# EAGLE schematic ESPSwitchBoard (EAGLE 7.3.0)
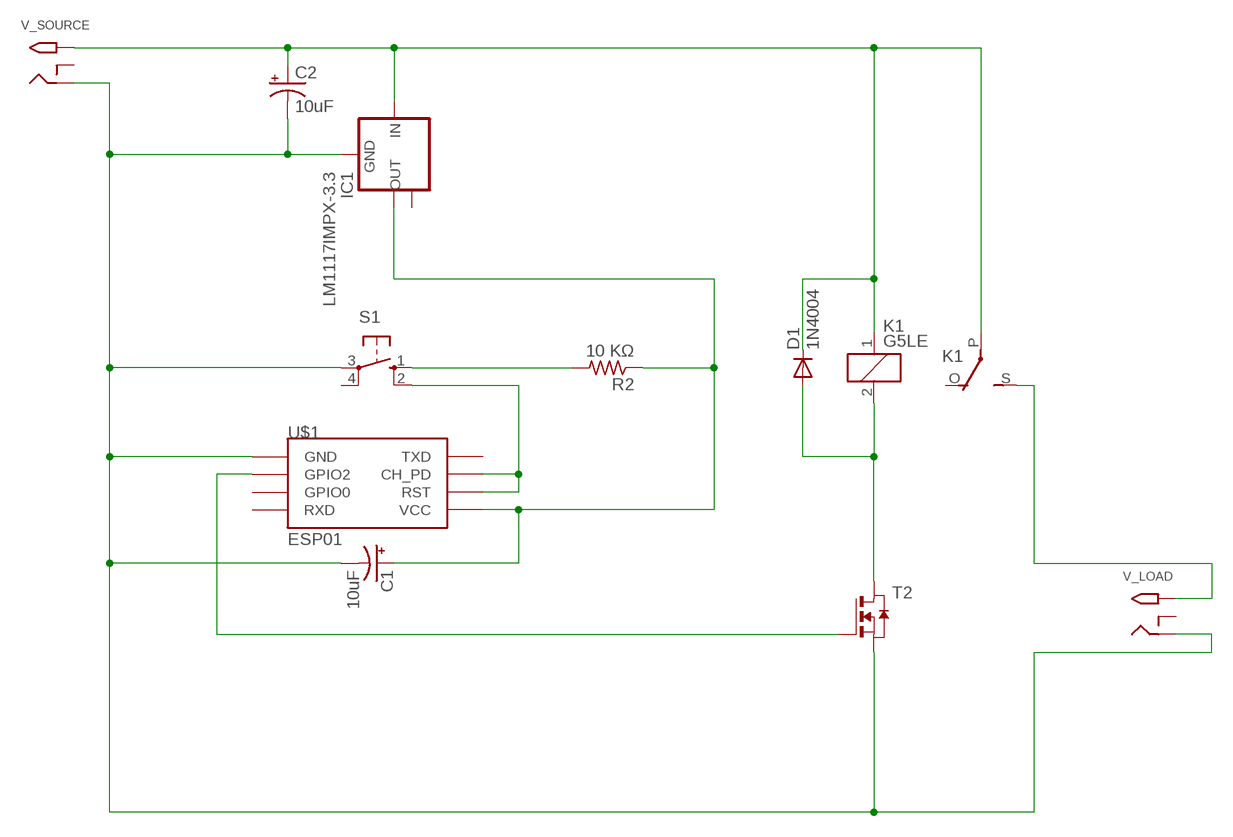
[diagram p0: schematic, sheet 1]

## Parts
C1  10uF  10UF-TANT  [EIA3216]
C2  10uF  10UF-TANT  [EIA3216]
D1  1N4004  [DO41-10]
IC1  LM1117IMPX-3.3  [SOT223]
K1  G5LE  [G5LE]
R2  10 KΩ  R-US_R0603  [R0603]
S1  10-XX  [B3F-10XX]
T2  NMOSSOT23  [SOT-23]
U$1  ESP01  [ESP01]
V_LOAD  2.1MMJACKTHM  [PJ-102A]
V_SOURCE  2.1MMJACKTHM  [PJ-102A]

## Nets
N$1: C2.A(+) D1.C IC1.3(IN) K1.1 K1.P(2:P) V_SOURCE.TIP
N$2: C1.C(-) C2.C(-) IC1.1(GND) S1.3(P) T2.2(S) U$1.GND V_LOAD.RING V_SOURCE.RING
N$3: C1.A(+) IC1.2(OUT) R2.1 U$1.VCC
N$4: K1.S(2:S) V_LOAD.TIP
N$5: D1.A K1.2 T2.1(D)
N$6: R2.2 S1.1(S)
N$7: T2.3(G) U$1.GPIO2
N$9: S1.2(S1) U$1.CH_PD U$1.RST
Unconnected: IC1.TAB(OUT1) K1.O(2:O) S1.4(P1) U$1.GPIO0 U$1.RX(RXD) U$1.TX(TXD) V_LOAD.RING_SW V_SOURCE.RING_SW

## Library data of the parts
C1 C2 = SparkFun-Retired:10UF-TANT: 10uF Tantalum SMT CAP-00811- 16V 10% (EIA-3216); PROD_ID: CAP-00811
D1 = diode:1N4004: DIODE general purpose rectifier, 1 A
IC1 = lm1117:LM1117IMPX-*
K1 = relay:G5LE: RELAY 1 x switch, 10 A/120 V AC, 8 A/30 V DC, Omron; OC_FARNELL: unknown; OC_NEWARK: unknown
R2 = adafruit:R-US_: RESISTOR, American symbol
S1 = switch-omron:10-XX: OMRON SWITCH; MPN: B3F-1000; OC_FARNELL: 176432; OC_NEWARK: 36M3542
T2 = zetex:NMOSSOT23: MOS FET; OC_FARNELL: unknown; OC_NEWARK: unknown
U$1 = esp8266modules:ESP01: ESP8266 Wifi module 01
V_LOAD V_SOURCE = adafruit:2.1MMJACK: 2.1mm x 5.5mm THM DC jack with internal switch. Digikey part #PJ-102A, 4UCON part #05537 2.1mm x 5.5mm SMT DC jack with internal switch. Digikey part #PJ-002A-SMT, 4UCON part #03267 By microbuilder.eu & adafruit.com